# EAGLE schematic rapidshark-main-breakout-top-mk-1.7-fab (EAGLE 6.5.0)
AUTHOR: sean@yak.net
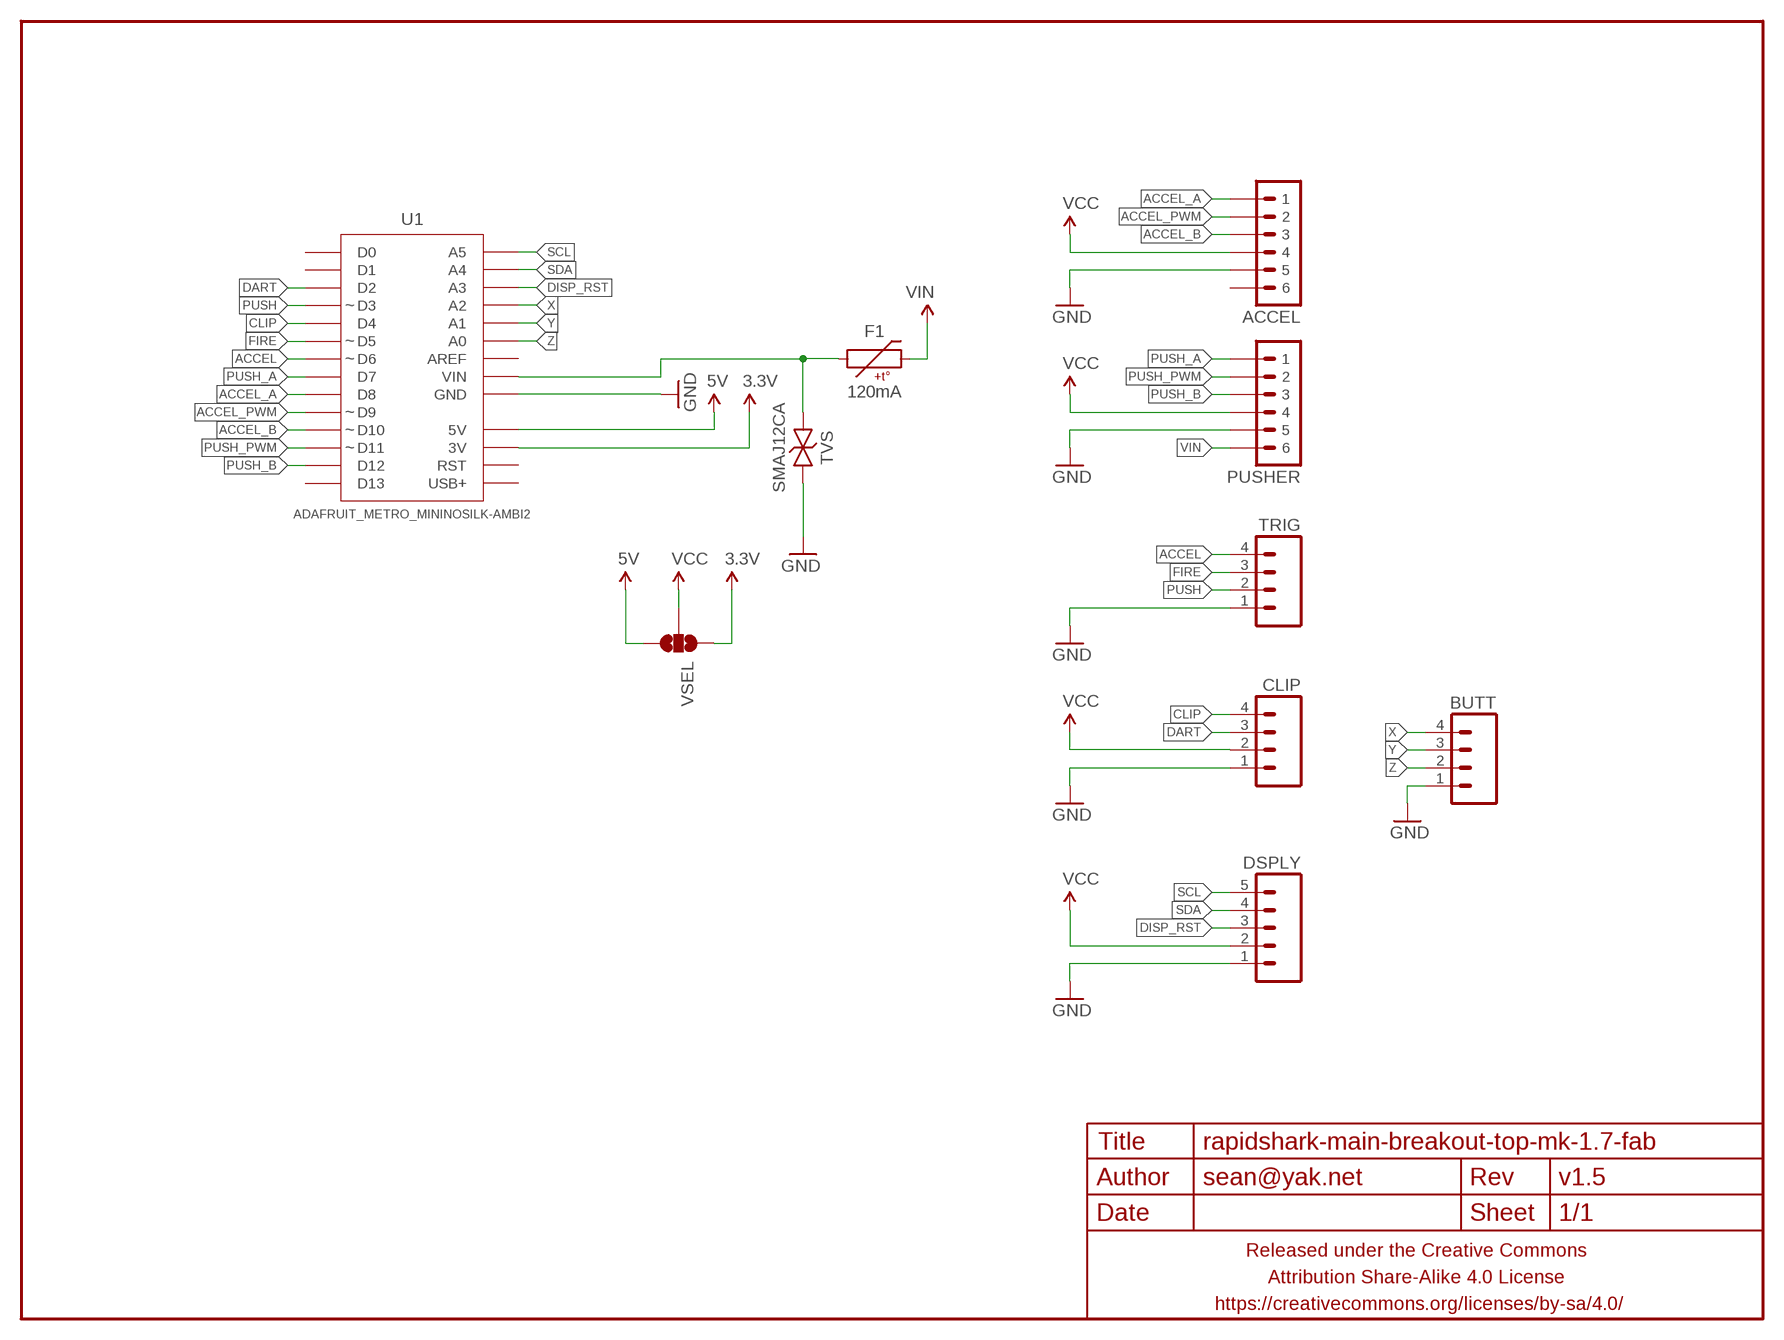
[diagram p0: schematic, sheet 1]

## Parts
ACCEL  M06JST-PH-PTH-VERT  [JST-6-PH-VERT-PTH]
BUTT  M04JST-PTH-VERT  [JST-4-PH-VERT-PTH]
CLIP  M04JST-PTH-VERT  [JST-4-PH-VERT-PTH]
DSPLY  M05JST-PH-VERT-PTH  [JST-5-PH-VERT-PTH]
F1  120mA  PTCSMD  [PTC-1206]
FRAME1  FRAME-LETTERNO_PACKAGE  [DUMMY]
PUSHER  M06JST-PH-PTH-VERT  [JST-6-PH-VERT-PTH]
TRIG  M04JST-PTH-VERT  [JST-4-PH-VERT-PTH]
TVS  SMAJ12CA  TVSSMA  [SMA-DIODE-TVS-BIDIR]
U1  ADAFRUIT_METRO_MININOSILK-AMBI2  [ADAFRUIT_METRO_MINI_BACK]
VSEL  JUMPER-PAD-3-NOFULL_BOX_SILK  [PAD-JUMPER-3-NO_YES_SILK_FULL_BOX]

## Nets
3.3V: U1.17(3V) VSEL.1
5V: U1.18(5V) VSEL.3
ACCEL: TRIG.4 U1.7(D6)
ACCEL_A: ACCEL.1 U1.9(D8)
ACCEL_B: ACCEL.3 U1.11(D10)
ACCEL_PWM: ACCEL.2 U1.10(D9)
CLIP: CLIP.4 U1.5(D4)
DART: CLIP.3 U1.3(D2)
DISP_RST: DSPLY.3 U1.26(A3)
FIRE: TRIG.3 U1.6(D5)
GND: ACCEL.5 BUTT.1 CLIP.1 DSPLY.1 PUSHER.5 TRIG.1 TVS.1 U1.19(GND) U1.20(GND)
N$1: F1.1 TVS.2 U1.21(VIN)
PUSH: TRIG.2 U1.4(D3)
PUSH_A: PUSHER.1 U1.8(D7)
PUSH_B: PUSHER.3 U1.13(D12)
PUSH_PWM: PUSHER.2 U1.12(D11)
SCL: DSPLY.5 U1.28(A5)
SDA: DSPLY.4 U1.27(A4)
VCC: ACCEL.4 CLIP.2 DSPLY.2 PUSHER.4 VSEL.2
VIN: F1.2 PUSHER.6
X: BUTT.4 U1.25(A2)
Y: BUTT.3 U1.24(A1)
Z: BUTT.2 U1.23(A0)
Unconnected: ACCEL.6 U1.1(D0) U1.2(D1) U1.14(D13) U1.15(USB+) U1.16(RST) U1.22(AREF)

## Library data of the parts
ACCEL PUSHER = A_butts:M06: Header 6 Standard 6-pin 0.1" header. Use with straight break away headers (SKU : PRT-00116), right angle break away headers (PRT-00553), swiss pins (PRT-00743), machine pins (PRT-00117), and female headers (PRT-00115). Molex polarized connector foot print use with SKU : PRT-08094 with associated crimp pins and housings. NOTES ON THE VARIANTS LOCK and LOCK_LONGPADS... This footprint was designed to help hold the alignment of a through-hole component (i.e. 6-pin header) while soldering it into place. You may notice that each hole has been shifted either up or down by 0.005 of an inch from it's more standard position (which is a perfectly straight line). This slight alteration caused the pins (the squares in the middle) to touch the edges of the holes. Because they are alternating, it causes a "brace" to hold the component in place. 0.005 has proven to be the perfect amount of "off-center" position when using our standard breakaway headers. Although looks a little odd when you look at the bare footprint, once you have a header in there, the alteration is very hard to notice. Also,if you push a header all the way into place, it is covered up entirely on the bottom side. This idea of altering the position of holes to aid alignment will be further integrated into the Sparkfun Library for other footprints. It can help hold any component with 3 or more connection pins.
BUTT CLIP TRIG = A_butts:M04: Header 4 Standard 4-pin 0.1" header. Use with straight break away headers (SKU : PRT-00116), right angle break away headers (PRT-00553), swiss pins (PRT-00743), machine pins (PRT-00117), and female headers (PRT-00115). Molex polarized connector foot print use with SKU : PRT-08231 with associated crimp pins and housings. 1MM SMD Version SKU: PRT-10208
DSPLY = A_butts:M05: Header 5 Standard 5-pin 0.1" header. Use with straight break away headers (SKU : PRT-00116), right angle break away headers (PRT-00553), swiss pins (PRT-00743), machine pins (PRT-00117), and female headers (PRT-00115). Molex polarized connector foot print use with SKU : PRT-08230 with associated crimp pins and housings.
F1 = A_butts:PTC: Resettable Fuse PTC Resettable Fuse. Spark Fun Electronics SKU : COM-08357; PROD_ID: RES-11150
FRAME1 = A_butts:FRAME-LETTER: Schematic Frame Standard 8.5x11 US Letter frame; DESIGNER: sean@yak.net; VERSION: v1.5
TVS = A_butts:TVS: Transient voltage suppressor- prevents ESD on inputs. Ignore package description- MBRA140 is NOT this type of part!!!
U1 = A_butts:ADAFRUIT_METRO_MINI
VSEL = A_butts:JUMPER-PAD-3-NO